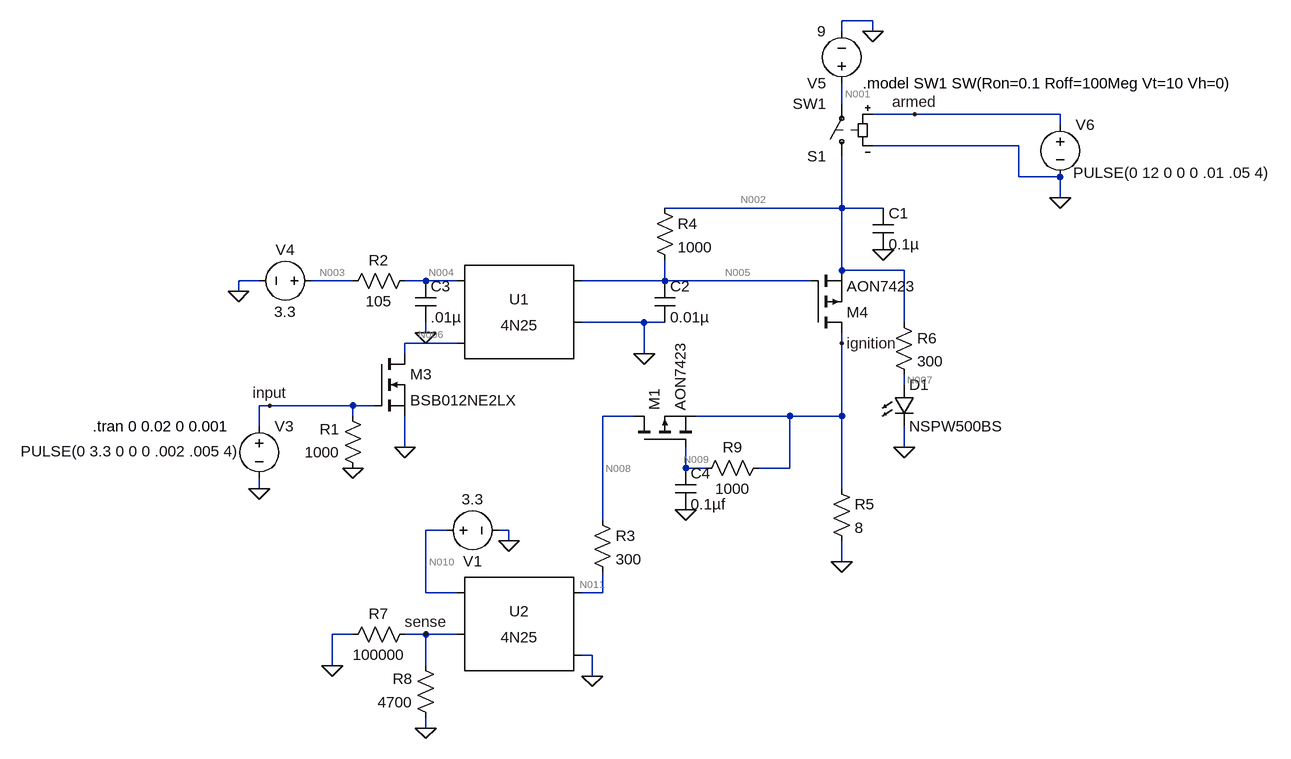
[diagram p0: schematic Pyro.asc]
Pyro.asc, the LTspice schematic file:
Version 4
SHEET 1 3088 724
WIRE 2096 -384 2048 -384
WIRE 2048 -368 2048 -384
WIRE 2096 -368 2096 -384
WIRE 2048 -256 2048 -288
WIRE 2160 -240 2096 -240
WIRE 2384 -240 2160 -240
WIRE 2384 -224 2384 -240
WIRE 2320 -192 2096 -192
WIRE 2320 -144 2320 -192
WIRE 2384 -144 2320 -144
WIRE 2384 -112 2384 -144
WIRE 2048 -96 2048 -176
WIRE 2048 -96 1776 -96
WIRE 2112 -96 2048 -96
WIRE 2048 0 2048 -96
WIRE 2144 0 2048 0
WIRE 1152 16 1120 16
WIRE 1296 16 1232 16
WIRE 1408 16 1376 16
WIRE 1456 16 1408 16
WIRE 1776 16 1776 -16
WIRE 1776 16 1648 16
WIRE 2000 16 1776 16
WIRE 1120 32 1120 16
WIRE 1744 80 1648 80
WIRE 1776 80 1744 80
WIRE 2144 80 2144 0
WIRE 1408 96 1408 80
WIRE 1456 112 1376 112
WIRE 2048 112 2048 96
WIRE 1376 128 1376 112
WIRE 1744 128 1744 80
WIRE 2144 176 2144 160
WIRE 1168 208 1152 208
WIRE 1296 208 1168 208
WIRE 1328 208 1296 208
WIRE 1296 224 1296 208
WIRE 1728 224 1680 224
WIRE 1968 224 1824 224
WIRE 2048 224 2048 112
WIRE 2048 224 1968 224
WIRE 1152 240 1152 208
WIRE 1376 272 1376 224
WIRE 2144 272 2144 240
WIRE 1808 304 1808 272
WIRE 1840 304 1808 304
WIRE 1968 304 1968 224
WIRE 1968 304 1920 304
WIRE 1152 336 1152 320
WIRE 2048 336 2048 224
WIRE 1680 384 1680 224
WIRE 1440 400 1408 400
WIRE 1536 400 1520 400
WIRE 1536 416 1536 400
WIRE 2048 448 2048 416
WIRE 1408 496 1408 400
WIRE 1456 496 1408 496
WIRE 1680 496 1680 464
WIRE 1680 496 1648 496
WIRE 1296 560 1264 560
WIRE 1408 560 1376 560
WIRE 1456 560 1408 560
WIRE 1664 592 1648 592
WIRE 1264 608 1264 560
WIRE 1408 608 1408 560
WIRE 1664 624 1664 592
WIRE 1408 704 1408 688
FLAG 1168 208 input
FLAG 2048 112 ignition
FLAG 1376 272 0
FLAG 1120 32 0
FLAG 2096 -368 0
FLAG 1152 336 0
FLAG 2048 448 0
FLAG 2144 272 0
FLAG 2384 -112 0
FLAG 2160 -240 armed
FLAG 1408 96 0
FLAG 2112 -32 0
FLAG 1664 624 0
FLAG 1536 416 0
FLAG 1408 704 0
FLAG 1264 608 0
FLAG 1408 560 sense
FLAG 1744 128 0
FLAG 1808 368 0
FLAG 1296 304 0
SYMBOL Optos\\4N25 1552 80 R0
SYMATTR InstName U1
SYMBOL nmos 1328 128 R0
SYMATTR InstName M3
SYMATTR Value BSB012NE2LX
SYMBOL voltage 1248 16 R90
WINDOW 0 -32 56 VBottom 2
WINDOW 3 32 56 VTop 2
WINDOW 123 0 0 Left 0
WINDOW 39 0 0 Left 0
SYMATTR InstName V4
SYMATTR Value 3.3
SYMBOL res 1392 0 R90
WINDOW 0 0 56 VBottom 2
WINDOW 3 32 56 VTop 2
SYMATTR InstName R2
SYMATTR Value 105
SYMBOL voltage 2048 -272 R180
WINDOW 123 0 0 Left 0
WINDOW 39 0 0 Left 0
SYMATTR InstName V5
SYMATTR Value 9
SYMBOL voltage 1152 224 R0
WINDOW 3 -367 54 Left 2
WINDOW 123 0 0 Left 0
WINDOW 39 0 0 Left 0
SYMATTR Value PULSE(0 3.3 0 0 0 .002 .005 4)
SYMATTR InstName V3
SYMBOL pmos 2000 96 M180
SYMATTR InstName M4
SYMATTR Value AON7423
SYMBOL res 2032 320 R0
SYMATTR InstName R5
SYMATTR Value 8
SYMBOL LED 2128 176 R0
SYMATTR InstName D1
SYMATTR Value NSPW500BS
SYMBOL sw 2048 -160 R180
SYMATTR InstName S1
SYMATTR Value SW1
SYMBOL voltage 2384 -240 R0
WINDOW 3 20 90 Left 2
WINDOW 123 0 0 Left 0
WINDOW 39 0 0 Left 0
SYMATTR Value PULSE(0 12 0 0 0 .01 .05 4)
SYMATTR InstName V6
SYMBOL res 2128 64 R0
SYMATTR InstName R6
SYMATTR Value 300
SYMBOL cap 1392 16 R0
SYMATTR InstName C3
SYMATTR Value .01µ
SYMATTR SpiceLine V=12
SYMBOL cap 2096 -96 R0
SYMATTR InstName C1
SYMATTR Value 0.1µ
SYMBOL cap 1760 16 R0
SYMATTR InstName C2
SYMATTR Value 0.01µ
SYMBOL Optos\\4N25 1552 560 M0
SYMATTR InstName U2
SYMBOL res 1664 368 R0
SYMATTR InstName R3
SYMATTR Value 300
SYMBOL voltage 1424 400 R270
WINDOW 0 -32 56 VBottom 2
WINDOW 3 32 56 VTop 2
WINDOW 123 0 0 Left 0
WINDOW 39 0 0 Left 0
SYMATTR InstName V1
SYMATTR Value 3.3
SYMBOL res 1392 544 R90
WINDOW 0 0 56 VBottom 2
WINDOW 3 32 56 VTop 2
SYMATTR InstName R7
SYMATTR Value 100000
SYMBOL res 1424 704 R180
WINDOW 0 36 76 Left 2
WINDOW 3 36 40 Left 2
SYMATTR InstName R8
SYMATTR Value 4700
SYMBOL res 1760 -112 R0
SYMATTR InstName R4
SYMATTR Value 1000
SYMBOL res 1312 320 R180
WINDOW 0 36 76 Left 2
WINDOW 3 36 40 Left 2
SYMATTR InstName R1
SYMATTR Value 1000
SYMBOL pmos 1728 272 R270
SYMATTR InstName M1
SYMATTR Value AON7423
SYMBOL res 1936 288 R90
WINDOW 0 0 56 VBottom 2
WINDOW 3 32 56 VTop 2
SYMATTR InstName R9
SYMATTR Value 1000
SYMBOL cap 1792 304 R0
SYMATTR InstName C4
SYMATTR Value 0.1µf
TEXT 2080 -288 Left 2 !.model SW1 SW(Ron=0.1 Roff=100Meg Vt=10 Vh=0)
TEXT 896 240 Left 2 !.tran 0 0.02 0 0.001

The netlist it stands for:
* Pyro.asc
XU1 N004 N006 N005 0 NC_01 4N25
M3 N006 input 0 0 BSB012NE2LX
V4 N003 0 3.3
R2 N004 N003 105
V5 N001 0 9
V3 input 0 PULSE(0 3.3 0 0 0 .002 .005 4)
M4 ignition N005 N002 N002 AON7423
R5 ignition 0 8
D1 N007 0 NSPW500BS
S1 N002 N001 armed 0 SW1
V6 armed 0 PULSE(0 12 0 0 0 .01 .05 4)
R6 N002 N007 300
C3 N004 0 .01µ V=12
C1 N002 0 0.1µ
C2 N005 0 0.01µ
XU2 N011 0 N010 sense NC_02 4N25
R3 N008 N011 300
V1 N010 0 3.3
R7 sense 0 100000
R8 0 sense 4700
R4 N002 N005 1000
R1 0 input 1000
M1 N008 N009 ignition ignition AON7423
R9 ignition N009 1000
C4 N009 0 0.1µf
.model D D
.lib standard.dio
.model NMOS NMOS
.model PMOS PMOS
.lib standard.mos
.model SW1 SW(Ron=0.1 Roff=100Meg Vt=10 Vh=0)
.tran 0 0.02 0 0.001
.lib 4N25.sub
.backanno
.end

* Results of the author's LTspice run, read from the files saved beside the schematic
* Operating Point, zero values left out:
*   V(n006) = 2.718 V
*   V(n004) = 3.3 V
*   V(n005) = 904.4 mV
*   V(n003) = 3.3 V
*   V(n001) = 9 V
*   V(ignition) = 277.6 nV
*   V(n002) = 904.4 mV
*   V(n007) = 904.4 mV
*   V(n011) = 277.6 nV
*   V(n010) = 3.3 V
*   V(sense) = 91.38 nV
*   V(n008) = 277.6 nV
*   V(n009) = 277.6 nV
*   Id(M4) = -34.7 nA
*   Is(M4) = 34.7 nA
*   Id(M3) = 55.64 pA
*   Is(M3) = -55.64 pA
*   I(D1) = 46.26 nA
*   I(R4) = 2.871 pA
*   I(R8) = -19.44 pA
*   I(R6) = 46.26 nA
*   I(R5) = 34.7 nA
*   I(R2) = -59.78 pA
*   I(S1) = 80.96 nA
*   I(V1) = -20.36 pA
*   I(V5) = -80.96 nA
*   I(V4) = -59.78 pA
*   Ix(u1:1) = 59.78 pA
*   Ix(u1:2) = -59.78 pA
*   Ix(u1:3) = 2.871 pA
*   Ix(u1:4) = -2.871 pA
*   Ix(u2:3) = 20.36 pA
*   Ix(u2:4) = -20.36 pA
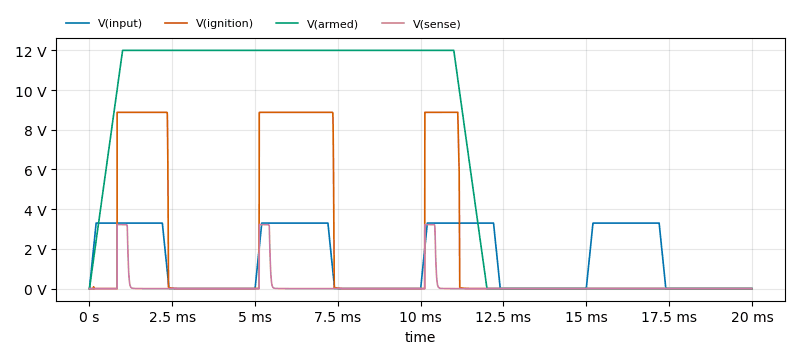
[diagram p1: Transient Analysis of Pyro.asc, plotted from the saved traces]
* Transient Analysis, 1 run:
*   V(input): min 0 V, max 3.3 V, average 1.452 V, rms 2.156 V, last 0 V
*   V(ignition): min -9.048 mV, max 8.882 V, average 2.143 V, rms 4.353 V, last 0 V
*   V(armed): min 0 V, max 12 V, average 6.6 V, rms 8.764 V, last 0 V
*   V(sense): min -1.37 µV, max 3.224 V, average 163.6 mV, rms 709.3 mV, last 10.64 µV